# Altium project ACS.PrjPcb
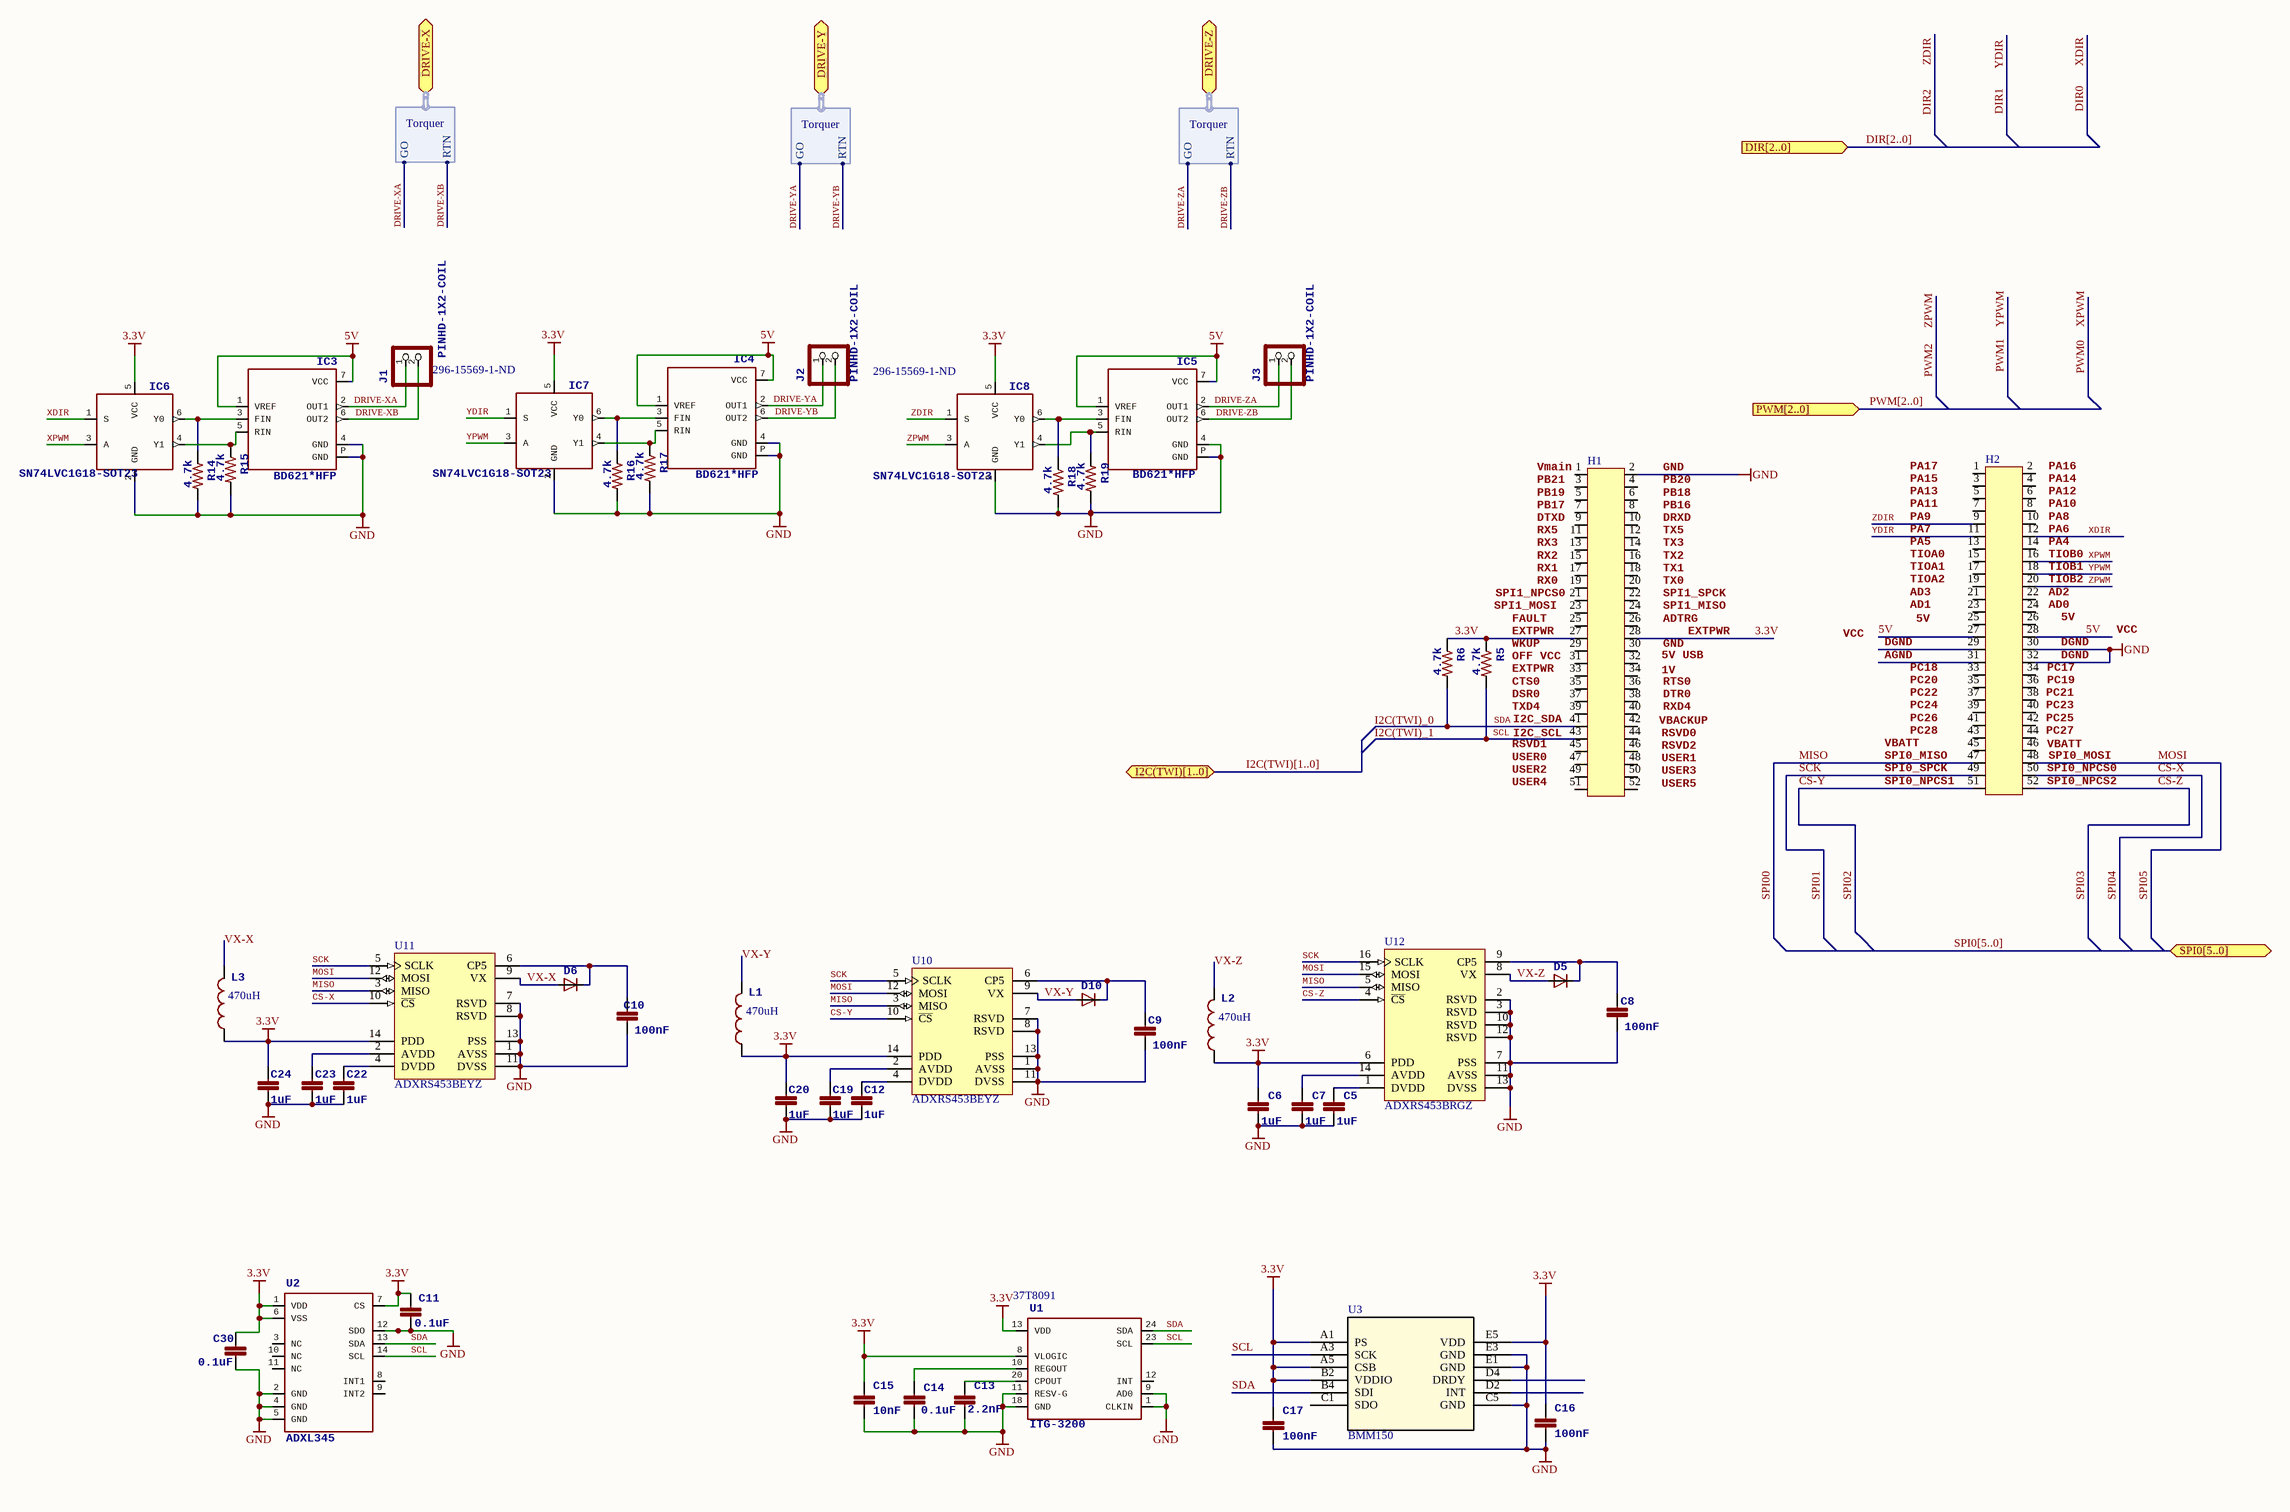
[diagram p0: ACS.SchDoc.SchDoc]
1 sheet, 50 parts. Net scope: flat (ports and power ports of the same name join across sheets).
Board file: ACS_2.PcbDoc

## Sheet ACS.SchDoc.SchDoc: ACS Board for YUsend-QB50
size C; Date: 2014-07-29 11:58:47 AM; DrawnBy: Mark A. Post, H. Chesser; Revision: 2; SheetNumber: 1; A: A; B: B; C: C; E: E; F: F; H: H; 1: 1; 2: 2; 3: 3; 4: 4; 5: 5; Version:: Version:

### Parts
C5  1uF  [0603-CAP]
C6  1uF  [0603-CAP]
C7  1uF  [0603-CAP]
C8  100nF  [0603-CAP]
C9  100nF  [0603-CAP]
C10  100nF  [0603-CAP]
C11  0.1uF  [0603-CAP]
C12  1uF  [0603-CAP]
C13  2.2nF  [0603-CAP]
C14  0.1uF  [0603-CAP]
C15  10nF  [0603-CAP]
C16  100nF  [0603-CAP]
C17  100nF  [0603-CAP]
C19  1uF  [0603-CAP]
C20  1uF  [0603-CAP]
C22  1uF  [0603-CAP]
C23  1uF  [0603-CAP]
C24  1uF  [0603-CAP]
C30  0.1uF  [0603-CAP]
D5  <b>Diode</b> / Standard reverse protection diodes and small signal diodes.  [DIODE-SMA]  (value not drawn)
D6  <b>Diode</b> / Standard reverse protection diodes and small signal diodes.  [DIODE-SMA]  (value not drawn)
D10  <b>Diode</b> / Standard reverse protection diodes and small signal diodes.  [DIODE-SMA]  (value not drawn)
H1  H?  [SAMTEC_ESQ_126_39_G_D]  (value not drawn)
H2  H?  [SAMTEC_ESQ_126_39_G_D]  (value not drawn)
IC3  BD621*HFP  [HRP7]
IC4  BD621*HFP  [HRP7]
IC5  BD621*HFP  [HRP7]
IC6  SN74LVC1G18-SOT23  [SOT23-6]
IC7  SN74LVC1G18-SOT23  Supplier Part Number 1: 296-15569-1-ND  [SOT23-6]
IC8  SN74LVC1G18-SOT23  Supplier Part Number 1: 296-15569-1-ND  [SOT23-6]
J1  PINHD-1X2-COIL  [HEADER-1X2-COIL]
J2  PINHD-1X2-COIL  [HEADER-1X2-COIL]
J3  PINHD-1X2-COIL  [HEADER-1X2-COIL]
L1  value 470uH  [1210]  (hidden comment: <b>Inductors</b>)
L2  value 470uH  [1210]  (hidden comment: <b>Inductors</b>)
L3  value 470uH  [1210]  (hidden comment: Inductor)
R5  4.7k  [0603-RES]
R6  4.7k  [0603-RES]
R14  4.7k  [0603-RES]
R15  4.7k  [0603-RES]
R16  4.7k  [0603-RES]
R17  4.7k  [0603-RES]
R18  4.7k  [0603-RES]
R19  4.7k  [0603-RES]
U1  ITG-3200  Supplier Part Number 1: 37T8091  [QFN-24]
U2  ADXL345  [LGA14]
U3  BMM150  [BGA_1590X1590]
U10  ADXRS453BEYZ  [ADI-EY-14-1_V]
U11  ADXRS453BEYZ  [ADI-EY-14-1_V]
U12  ADXRS453BRGZ  [ADI-RG-16-1_M]

### Ports
DIR[2..0] (in), DRIVE-X (harness Torquer), DRIVE-Y (harness Torquer), DRIVE-Z (harness Torquer), I2C(TWI)[1..0] (bidir), PWM[2..0] (in), SPI0[5..0] (bidir)

### Harnesses
Torquer: GO, RTN

### Nets
3.3V: C6.2 C11.1 C15.1 C16.1 C17.1 C20.2 C24.2 C30.1 H1.27 H1.28 IC6.5(VCC) IC7.5(VCC) IC8.5(VCC) L1.1 L2.1 L3.1 R5.1 R6.1 U1.8(VLOGIC) U1.13(VDD) U2.1(VDD) U2.6(VSS) U2.7(CS) U3.A1(PS) U3.A5(CSB) U3.B2(VDDIO) U3.E5(VDD) U10.14(PDD) U11.14(PDD) U12.6(PDD)
5V: H2.27 H2.28 IC3.1(VREF) IC3.7(VCC) IC4.1(VREF) IC4.7(VCC) IC5.1(VREF) IC5.7(VCC)
GND: C5.1 C6.1 C7.1 C8.2 C9.2 C10.2 C11.2 C12.1 C13.2 C14.2 C15.2 C16.2 C17.2 C19.1 C20.1 C22.1 C23.1 C24.1 C30.2 H1.2 H2.30 H2.32 IC3.4(GND) IC3.P(GND) IC4.4(GND) IC4.P(GND) IC5.4(GND) IC5.P(GND) IC6.2(GND) IC7.2(GND) IC8.2(GND) R14.2 R15.2 R16.2 R17.2 R18.2 R19.2 U1.1(CLKIN) U1.9(AD0) U1.11(RESV-G) U1.18(GND) U2.2(GND) U2.4(GND) U2.5(GND) U2.12(SDO) U3.C5(GND) U3.E1(GND) U3.E3(GND) U10.1(AVSS) U10.7(RSVD) U10.8(RSVD) U10.11(DVSS) U10.13(PSS) U11.1(AVSS) U11.7(RSVD) U11.8(RSVD) U11.11(DVSS) U11.13(PSS) U12.2(RSVD) U12.3(RSVD) U12.7(PSS) U12.10(RSVD) U12.11(AVSS) U12.12(RSVD) U12.13(DVSS)
CS-X: H2.50 U11.10(~{CS})  [also labelled SPI04]
CS-Y: H2.51 U10.10(~{CS})  [also labelled SPI02]
CS-Z: H2.52 U12.4(~{CS})  [also labelled SPI03]
DIR0: H2.12 IC6.1(S)  [also labelled XDIR]
DIR1: H2.11 IC7.1(S)  [also labelled YDIR]
DIR2: H2.9 IC8.1(S)  [also labelled ZDIR]
DRIVE-XA: IC3.2(OUT1) J1.1 ; port DRIVE-X.GO
DRIVE-XB: IC3.6(OUT2) J1.2 ; port DRIVE-X.RTN
DRIVE-YA: IC4.2(OUT1) J2.1 ; port DRIVE-Y.GO
DRIVE-YB: IC4.6(OUT2) J2.2 ; port DRIVE-Y.RTN
DRIVE-ZA: IC5.2(OUT1) J3.1 ; port DRIVE-Z.GO
DRIVE-ZB: IC5.6(OUT2) J3.2 ; port DRIVE-Z.RTN
I2C(TWI)_0: H1.41 R6.2 U1.24(SDA) U2.13(SDA) U3.B4(SDI)  [also labelled SDA]
I2C(TWI)_1: H1.43 R5.2 U1.23(SCL) U2.14(SCL) U3.A3(SCK)  [also labelled SCL]
MISO: H2.47 U10.3(MISO) U11.3(MISO) U12.5(MISO)  [also labelled SPI00]
MOSI: H2.48 U10.12(MOSI) U11.12(MOSI) U12.15(MOSI)  [also labelled SPI05]
PWM0: H2.16 IC6.3(A)  [also labelled XPWM]
PWM1: H2.18 IC7.3(A)  [also labelled YPWM]
PWM2: H2.20 IC8.3(A)  [also labelled ZPWM]
SCK: H2.49 U10.5(SCLK) U11.5(SCLK) U12.16(SCLK)  [also labelled SPI01]
VX-X: D6.A L3.2 U11.9(VX)
VX-Y: D10.A L1.2 U10.9(VX)
VX-Z: D5.A L2.2 U12.8(VX)
NetC5_2: C5.2 U12.1(DVDD)
NetC7_2: C7.2 U12.14(AVDD)
NetC8_1: C8.1 D5.C U12.9(CP5)
NetC9_1: C9.1 D10.C U10.6(CP5)
NetC10_1: C10.1 D6.C U11.6(CP5)
NetC12_2: C12.2 U10.4(DVDD)
NetC13_1: C13.1 U1.20(CPOUT)
NetC14_1: C14.1 U1.10(REGOUT)
NetC19_2: C19.2 U10.2(AVDD)
NetC22_2: C22.2 U11.4(DVDD)
NetC23_2: C23.2 U11.2(AVDD)
NetIC3_3: IC3.3(FIN) IC6.6(Y0) R14.1
NetIC3_5: IC3.5(RIN) IC6.4(Y1) R15.1
NetIC4_3: IC4.3(FIN) IC7.6(Y0) R16.1
NetIC4_5: IC4.5(RIN) IC7.4(Y1) R17.1
NetIC5_3: IC5.3(FIN) IC8.6(Y0) R18.1
NetIC5_5: IC5.5(RIN) IC8.4(Y1) R19.1

Not connected (* = marked no-connect by the designer): H1 1 3 4 5 6 7 8 9 10 11 12 13 14 15 16 17 18 19 20 21 22 23 24 25 26 29 30 31 32 33 34 35 36 37 38 39 40 42 44 45 46 47 48 49 50 51 52; H2 1 2 3 4 5 6 7 8 10 13 14 15 17 19 21 22 23 24 25 26 29 31 33 34 35 36 37 38 39 40 41 42 43 44 45 46; U1 12(INT); U2 3(NC) 8(INT1) 9(INT2) 10(NC) 11(NC); U3 C1(SDO) D2(INT) D4(DRDY)

### Buses and harness runs
bus DIR[2..0] = port DIR[2..0]
bus I2C(TWI)[1..0] = port I2C(TWI)[1..0]
bus PWM[2..0] = port PWM[2..0]
bus SPI0[5..0] = port SPI0[5..0]

### Notes on the sheet
- (near H1) Vmain
- (near H1) PB21
- (near H1) GND
- (near H1) PB20
- PA17
- PA15
- (near H2) PA16
- (near H2) PA14
- (near H1) PB19
- (near H1) PB17
- (near H1) DTXD
- (near H1) RX5
- (near H1) RX3
- (near H1) PB18
- (near H1) PB16
- (near H1) DRXD
- (near H1) TX5
- (near H1) TX3
- PA13
- PA11
- PA9
- PA7
- PA5
- (near H2) PA12
- (near H2) PA10
- (near H2) PA8
- (near H2) PA6
- (near H2) PA4
- SPI1_MOSI
- SPI1_NPCS0
- (near H1) RX2
- (near H1) RX1
- (near H1) RX0
- (near H1) TX2
- (near H1) TX1
- (near H1) TX0
- (near H1) SPI1_SPCK
- (near H1) SPI1_MISO
- (near H2) TIOA0
- (near H2) TIOA1
- (near H2) TIOA2
- AD3
- AD1
- (near H2) TIOB0
- (near H2) TIOB1
- (near H2) TIOB2
- (near H2) AD2
- (near H2) AD0
- FAULT
- EXTPWR
- (near R5) WKUP
- OFF VCC
- (near H1) 5V USB
- (near H1) 1V
- (near H1) ADTRG
- VCC
- DGND
- AGND
- PC18
- 5V
- (near H2) PC17
- (near H2) 5V
- (near H2) DGND
- (near R5) CTS0
- (near R5) DSR0
- TXD4
- I2C_SDA
- (near H1) I2C_SCL
- (near H1) VBACKUP
- (near H1) RSVD0
- (near H1) RTS0
- (near H1) DTR0
- (near H1) RXD4
- PC20
- PC22
- PC24
- PC26
- PC28
- (near H2) PC21
- (near H2) PC23
- (near H2) PC25
- (near H2) PC27
- (near H2) PC19
- RSVD1
- (near H1) USER0
- (near H1) USER2
- (near H1) USER4
- (near H1) RSVD2
- (near H1) USER1
- (near H1) USER3
- (near H1) USER5
- VBATT
- (near H2) SPI0_MISO
- (near H2) SPI0_SPCK
- (near H2) SPI0_NPCS1
- (near H2) VBATT
- (near H2) SPI0_NPCS0
- (near H2) SPI0_NPCS2
- (near H2) SPI0_MOSI

### Library data of the parts
C5-C15 C19 C20 C22-C24 C30 = CAPACITOR-0603: <b>Capacitor</b> / Standard SMT, and 0.1", and 0.2" leaded ceramic capacitors; Supplier 1: Digi-Key
  C5-C7 C12 C19 C20 C22-C24: Value: 1 uF; Supplier Part Number 1: 1276-1024-1-ND
  C8-C11 C14 C30: Supplier Part Number 1: 399-1096-1-ND
  C13: Supplier Part Number 1: 399-1085-1-ND
  C15: Supplier Part Number 1: 399-1091-1-ND
C16 C17 = CAPACITOR-0603
D5 D6 D10 = DIODE-SMA: Supplier 1: Digi-Key; Supplier Part Number 1: SMAJ4744A-TPCT-ND
H1 H2 = SAMTEC_ESQ_126_39_G_D: 26X2 header
IC3 = BD621*HFP: H-bridge driver for brush motors BD621* have minimum 3V power input, BD62*2 have 2A current rating</p> / Source: http://www.rohm.com/products/databook/motor/pdf/bd623x_series-e.pdf; MPN: BD6232HFP-TR; OC_FARNELL: 1712947; OC_NEWARK: 24R5627; Supplier 1: Digi-Key; Supplier Part Number 1: BD6212HFPCT-ND
IC4 IC5 = BD621*HFP: <b>H-bridge driver</b> for brush motors / <p>BD621* have minimum 3V power input, BD62*2 have 2A current rating</p> / Source: http://www.rohm.com/products/databook/motor/pdf/bd623x_series-e.pdf; MPN: BD6232HFP-TR; OC_FARNELL: 1712947; OC_NEWARK: 24R5627; Supplier 1: Digi-Key; Supplier Part Number 1: BD6212HFPCT-ND
IC6-IC8 = SN74LVC1G18-SOT23: <b>1-of-2 Noninverting Demultiplexer with 3-state Deselected Output</b> / <p>Function-Compatible with SN74AUC1G19 Decoder/Demultiplexer (for High Deselected Output)<p>; Supplier 1: Digi-Key
  IC6: Supplier Part Number 1: 296-15568-1-ND
L1-L3 = INDUCTOR-1210_470uH: Supplier 1: Digi-Key; Supplier Part Number 1: 490-2499-1-ND
R5 R6 R14-R19 = RESISTOR-0603: <p><b>Resistor</b></p> / Basic schematic elements and footprints for resistors.; Supplier 1: Digi-Key; Supplier Part Number 1: P4.7KGCT-ND
U1 = ITG-3200: ITG-3200 3-axis gyro, digital output, qfn24 package; Supplier 1: Newark
U3 = BMM150: Imported; Vendor: Bosch; Built_By: EMA_UL_Team; C: Copyright (C) 2016 Accelerated Designs. All rights reserved; Manufacturer_Part_Number: BMM150; RefDes: RefDes; Type: DEV; Value: Value
U10 U11 = CMP-0885-00107-1: High Performance, Digital Output Gyroscope with SPI, 77.5 Hz BW, Industrial, 14-pin LCC, Tube; Manufacturer: Analog Devices; Nonliniarity: 0.05% of FS rms; Supply Current: 6 mA; Temp Sensor: Yes; Sensitivity: 80 LSB/degrees/s; Voltage Reference: No; Voltage Supply (V): 3.15 to 5.25; PackageVersion: 05-23-2011-B, 05/2011; Output Type: Digital; ComponentLink1Description: Manufacturer URL; ComponentLink2Description: Datasheet; ComponentLink3URL: http:/www.analog.com/static/imported-files/packages/PKG_PDF/LCC(E)/EY_14_1.pdf; ComponentLink4URL: http://www.analog.com/en/mems-sensors/mems-inertial-sensors/adxrs453/products/product.html; ComponentLink2URL: http://www.analog.com/static/imported-files/data_sheets/ADXRS453.pdf; ComponentLink3Description: Package Specification; PartNumber: ADXRS453BEYZ; ComponentLink1URL: http://www.analog.com/en/index.html; PackageReference: EY-14-1; PackageDescription: 14-Pin Ceramic Leadless Chip Carrier, Vertical Form, 9 x 9 mm Body; DatasheetVersion: Rev. B; Mounting Technology: Surface Mount; ComponentLink4Description: Product URL; Packing: Tube; Supplier 1: Digi-Key; Supplier Part Number 1: ADXRS453BEYZ-ND
U12 = CMP-0885-00109-1: High Performance, Digital Output Gyroscope with SPI, 77.5 Hz BW, Industrial, 16-pin SOIC, Tube; Manufacturer: Analog Devices; Sensitivity: 80 LSB/degrees/s; Supply Current: 6 mA; Temp Sensor: Yes; Voltage Supply (V): 3.15 to 5.25; Voltage Reference: No; Nonliniarity: 0.05% of FS rms; ComponentLink1Description: Manufacturer URL; ComponentLink4URL: http://www.analog.com/en/mems-sensors/mems-inertial-sensors/adxrs453/products/product.html; Packing: Tube; ComponentLink2Description: Datasheet; DatasheetVersion: Rev. B; Mounting Technology: Surface Mount; PackageReference: RG-16-1; ComponentLink3Description: Package Specification; ComponentLink2URL: http://www.analog.com/static/imported-files/data_sheets/ADXRS453.pdf; ComponentLink4Description: Product URL; PackageDescription: 16-Pin Small Outline, Plastic Cavity Package, 10.3 x 7.8 mm Body, 1.27 mm Pitch; ComponentLink1URL: http://www.analog.com/en/index.html; PartNumber: ADXRS453BRGZ; ComponentLink3URL: http:/www.analog.com/static/imported-files/packages/PKG_PDF/SOIC_PCP(RG)/RG_16_1.pdf; Output Type: Digital; PackageVersion: 01-30-2013-B, 01/2013; Supplier 1: Digi-Key; Supplier Part Number 1: ADXRS453BRGZ-ND
J1-J3 = PINHD-1X2-COIL: Supplier 1: Digi-Key; Supplier Part Number 1: WM18920-ND
U2 = ADXL345: Supplier 1: Digi-Key; Supplier Part Number 1: ADXL345BCCZ-RLCT-ND